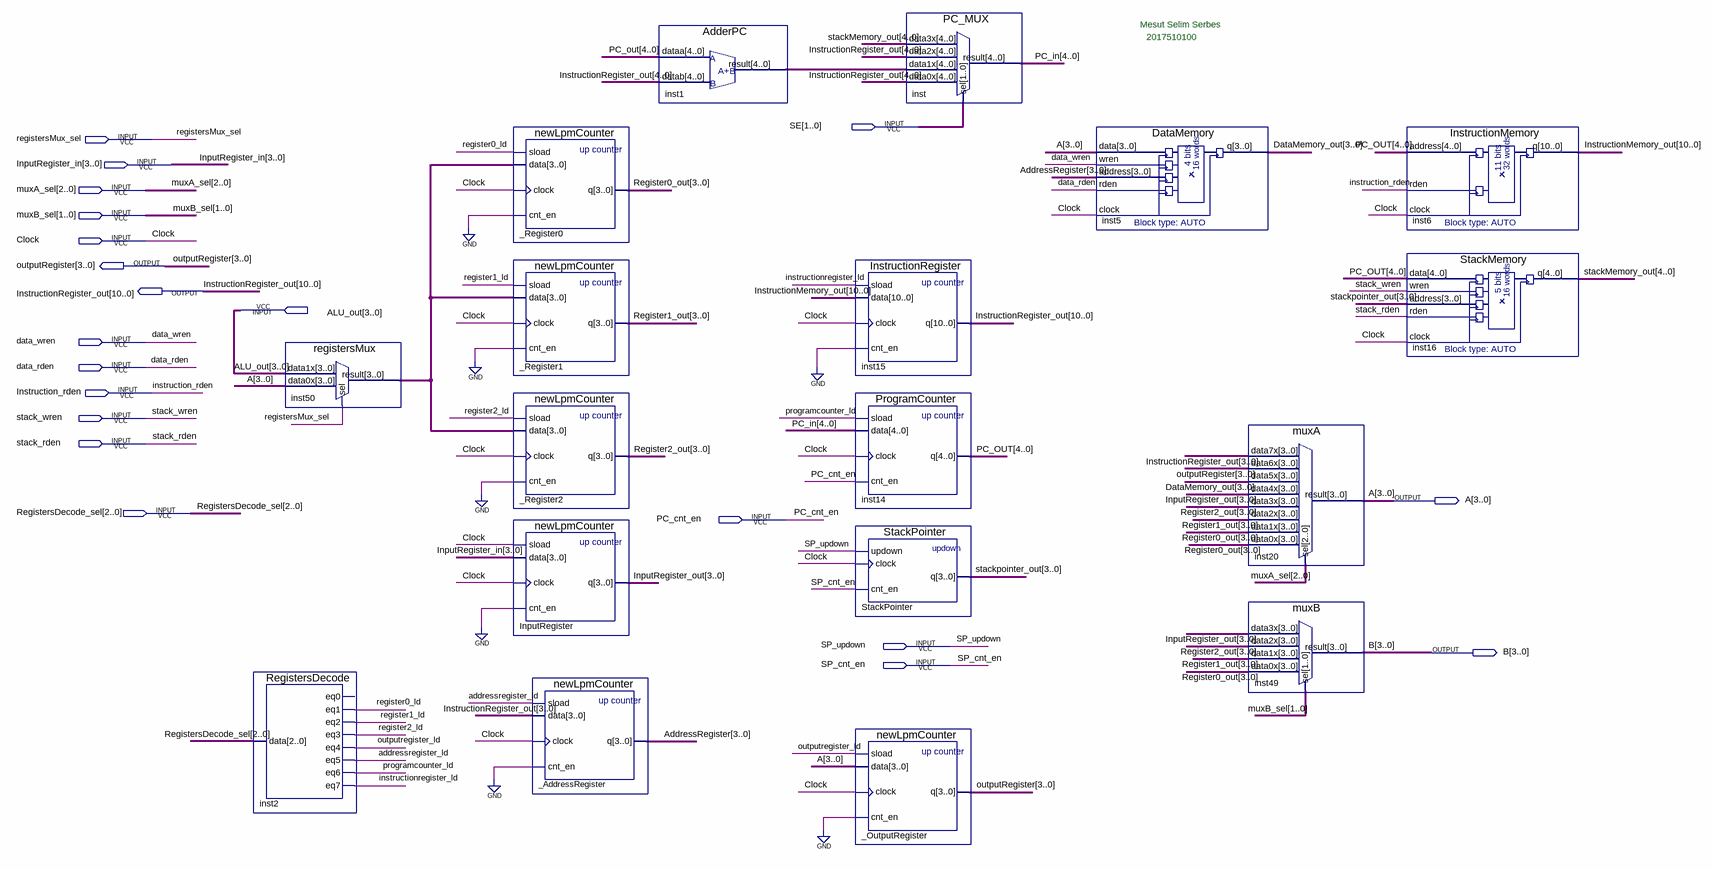
[diagram p0: schematic sheet]
// Quartus schematic BUS_Mesut_Selim_Serbes_2017510100.bdf as structural Verilog: 18 symbols, 20 pins
module BUS_Mesut_Selim_Serbes_2017510100 (
  input  [1:0] SE,
  input  registersMux_sel,
  input  [3:0] InputRegister_in,
  input  [2:0] muxA_sel,
  input  [1:0] muxB_sel,
  input  Clock,
  input  [3:0] ALU_out,
  input  data_wren,
  input  data_rden,
  input  Instruction_rden,
  input  stack_wren,
  input  stack_rden,
  input  [2:0] RegistersDecode_sel,
  input  PC_cnt_en,
  input  SP_updown,
  input  SP_cnt_en,
  output [3:0] outputRegister,
  output [10:0] InstructionRegister_out,
  output [3:0] A,
  output [3:0] B
);

  wire addressregister_ld, instructionregister_ld, outputregister_ld, programcounter_ld, register0_ld,
       register1_ld, register2_ld;
  wire [3:0] AddressRegister, DataMemory_out, InputRegister_out, inst50_result, Register0_out, Register1_out,
       Register2_out, stackpointer_out;
  wire [4:0] inst1_result, PC_in, PC_OUT, stackMemory_out;
  wire [10:0] InstructionMemory_out;

  RegistersDecode inst2 (
    .data(RegistersDecode_sel), .eq1(register0_ld), .eq2(register1_ld), .eq3(register2_ld),
    .eq4(outputregister_ld), .eq5(addressregister_ld), .eq6(programcounter_ld), .eq7(instructionregister_ld));  // open: eq0
  registersMux inst50 (.data1x(ALU_out), .data0x(A), .sel(registersMux_sel), .result(inst50_result));
  newLpmCounter _Register0 (
    .sload(register0_ld), .data(inst50_result), .clock(Clock), .cnt_en(1'b0), .q(Register0_out));
  newLpmCounter _Register1 (
    .sload(register1_ld), .data(inst50_result), .clock(Clock), .cnt_en(1'b0), .q(Register1_out));
  newLpmCounter _Register2 (
    .sload(register2_ld), .data(inst50_result), .clock(Clock), .cnt_en(1'b0), .q(Register2_out));
  newLpmCounter InputRegister (
    .sload(Clock), .data(InputRegister_in), .clock(Clock), .cnt_en(1'b0), .q(InputRegister_out));
  newLpmCounter _AddressRegister (
    .sload(addressregister_ld), .data(InstructionRegister_out[3:0]), .clock(Clock), .cnt_en(1'b0),
    .q(AddressRegister));
  AdderPC inst1 (.dataa(PC_OUT), .datab(InstructionRegister_out[4:0]), .result(inst1_result));
  InstructionRegister inst15 (
    .sload(instructionregister_ld), .data(InstructionMemory_out), .clock(Clock), .cnt_en(1'b0),
    .q(InstructionRegister_out));
  ProgramCounter inst14 (.sload(programcounter_ld), .data(PC_in), .clock(Clock), .cnt_en(PC_cnt_en), .q(PC_OUT));
  StackPointer StackPointer (.updown(SP_updown), .clock(Clock), .cnt_en(SP_cnt_en), .q(stackpointer_out));
  newLpmCounter _OutputRegister (.sload(outputregister_ld), .data(A), .clock(Clock), .cnt_en(1'b0), .q(outputRegister));
  PC_MUX inst (
    .data3x(stackMemory_out), .data2x(InstructionRegister_out[4:0]), .data1x(inst1_result),
    .data0x(InstructionRegister_out[4:0]), .sel(SE), .result(PC_in));
  DataMemory inst5 (
    .data(A), .wren(data_wren), .address(AddressRegister), .rden(data_rden), .clock(Clock), .q(DataMemory_out));
  muxA inst20 (
    .data7x(InstructionRegister_out[3:0]), .data6x(outputRegister), .data5x(DataMemory_out),
    .data4x(InputRegister_out), .data3x(Register2_out), .data2x(Register1_out), .data1x(Register0_out),
    .data0x(Register0_out), .sel(muxA_sel), .result(A));
  muxB inst49 (
    .data3x(InputRegister_out), .data2x(Register2_out), .data1x(Register1_out), .data0x(Register0_out),
    .sel(muxB_sel), .result(B));
  InstructionMemory inst6 (.address(PC_OUT), .rden(Instruction_rden), .clock(Clock), .q(InstructionMemory_out));
  StackMemory inst16 (
    .data(PC_OUT), .wren(stack_wren), .address(stackpointer_out), .rden(stack_rden), .clock(Clock),
    .q(stackMemory_out));

  // Notes on the sheet:
  //   Mesut Selim Serbes
  //   2017510100
endmodule
